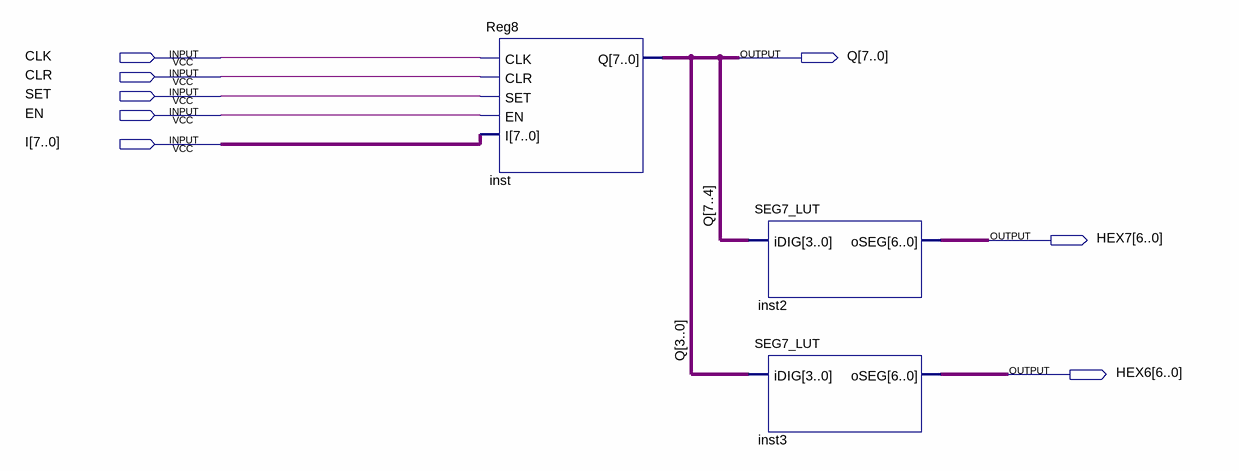
[diagram p0: schematic sheet]
// Quartus schematic Register8.bdf as structural Verilog: 3 symbols, 8 pins
module Register8 (
  input  CLK,
  input  CLR,
  input  SET,
  input  EN,
  input  [7:0] I,
  output [7:0] Q,
  output [6:0] HEX7,
  output [6:0] HEX6
);

  Reg8 inst (.CLK(CLK), .CLR(CLR), .SET(SET), .EN(EN), .I(I), .Q(Q));
  SEG7_LUT inst2 (.iDIG(Q[7:4]), .oSEG(HEX7));
  SEG7_LUT inst3 (.iDIG(Q[3:0]), .oSEG(HEX6));
endmodule
